# Altium schematic sheet takkkk.SchDoc
size 431 x 279 mm; SheetNumber: 1; SheetTotal: 1; ENG_APP_DATE: --/--/--; DSN_APP_DATE: --/--/--; CHK_APP_DATE: --/--/--
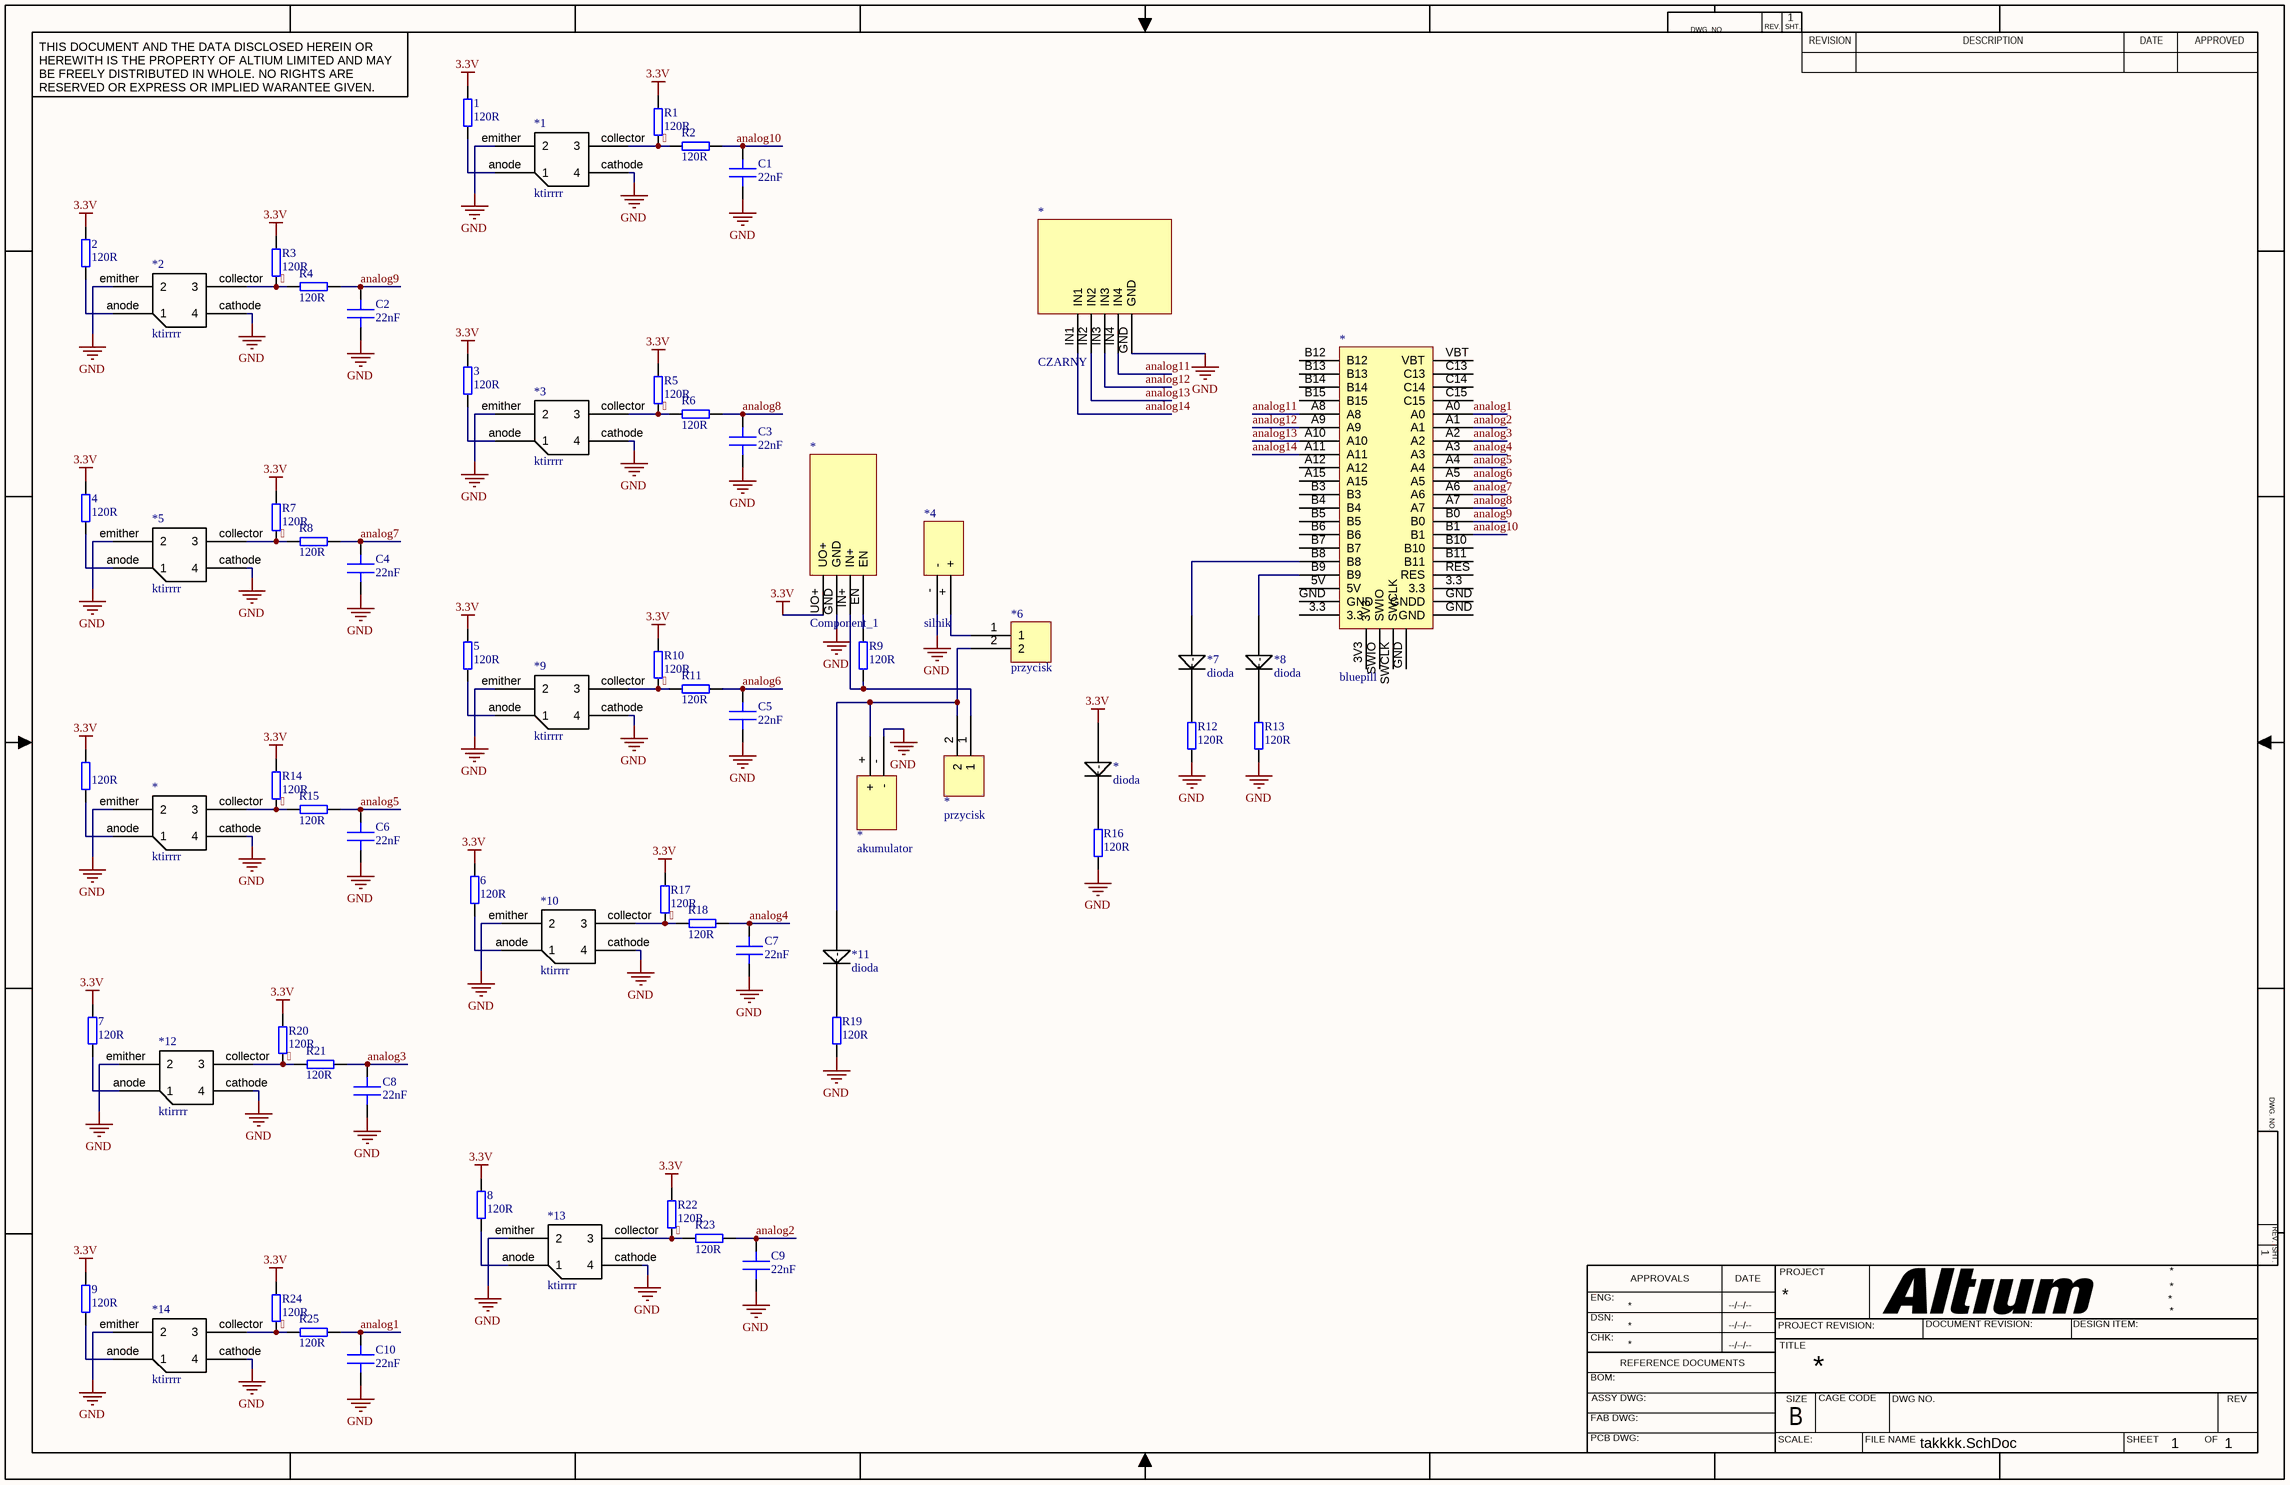
[diagram p0: takkkk.SchDoc]

## Parts
(Parts that share a designator on the sheet are numbered #1, #2 ... from top to bottom, then left to right.)
1  120R  [R 0402]
2  120R  [R 0402]
3  120R  [R 0402]
4  120R  [R 0402]
5  120R  [R 0402]
6  120R  [R 0402]
7  120R  [R 0402]
8  120R  [R 0402]
9  120R  [R 0402]
*1  ktirrrr
*2  ktirrrr
*3  ktirrrr
*4  silnik
*5  ktirrrr
*6  przycisk
*7  dioda
*8  dioda
*9  ktirrrr
*10  ktirrrr
*11  dioda
*12  ktirrrr
*13  ktirrrr
*14  ktirrrr
*#1  CZARNY
*#2  Component_1
*#3  bluepill
*#4  przycisk
*#5  akumulator
*#6  dioda
*#7  ktirrrr
?  120R  [R 0402]
C1  22nF  [C 0402]
C2  22nF  [C 0402]
C3  22nF  [C 0402]
C4  22nF  [C 0402]
C5  22nF  [C 0402]
C6  22nF  [C 0402]
C7  22nF  [C 0402]
C8  22nF  [C 0402]
C9  22nF  [C 0402]
C10  22nF  [C 0402]
R1  120R  [R 0402]
R2  120R  [R 0402]
R3  120R  [R 0402]
R4  120R  [R 0402]
R5  120R  [R 0402]
R6  120R  [R 0402]
R7  120R  [R 0402]
R8  120R  [R 0402]
R9  120R  [R 0402]
R10  120R  [R 0402]
R11  120R  [R 0402]
R12  120R  [R 0402]
R13  120R  [R 0402]
R14  120R  [R 0402]
R15  120R  [R 0402]
R16  120R  [R 0402]
R17  120R  [R 0402]
R18  120R  [R 0402]
R19  120R  [R 0402]
R20  120R  [R 0402]
R21  120R  [R 0402]
R22  120R  [R 0402]
R23  120R  [R 0402]
R24  120R  [R 0402]
R25  120R  [R 0402]

## Nets
3.3V: 1.2 2.2 3.2 4.2 5.2 6.2 7.2 8.2 9.2 *#2.UO+ *#6.1(+) ?.2 R1.1 R3.1 R5.1 R7.1 R10.1 R14.1 R17.1 R20.1 R22.1 R24.1
GND: *1.cathode(4) *1.emither(2) *2.cathode(4) *2.emither(2) *3.cathode(4) *3.emither(2) *4.- *5.cathode(4) *5.emither(2) *9.cathode(4) *9.emither(2) *10.cathode(4) *10.emither(2) *12.cathode(4) *12.emither(2) *13.cathode(4) *13.emither(2) *14.cathode(4) *14.emither(2) *#1.GND *#2.GND *#5.- *#7.cathode(4) *#7.emither(2) C1.2 C2.2 C3.2 C4.2 C5.2 C6.2 C7.2 C8.2 C9.2 C10.2 R12.1 R13.1 R16.1 R19.1
: *1.collector(3) *2.collector(3) *3.collector(3) *5.collector(3) *9.collector(3) *10.collector(3) *12.collector(3) *13.collector(3) *14.collector(3) *#7.collector(3) R1.2 R2.1 R3.2 R4.1 R5.2 R6.1 R7.2 R8.1 R10.2 R11.1 R14.2 R15.1 R17.2 R18.1 R20.2 R21.1 R22.2 R23.1 R24.2 R25.1
analog1: *#3.A0 C10.1 R25.2
analog2: *#3.A1 C9.1 R23.2
analog3: *#3.A2 C8.1 R21.2
analog4: *#3.A3 C7.1 R18.2
analog5: *#3.A4 C6.1 R15.2
analog6: *#3.A5 C5.1 R11.2
analog7: *#3.A6 C4.1 R8.2
analog8: *#3.A7 C3.1 R6.2
analog9: *#3.B0 C2.1 R4.2
analog10: *#3.B1 C1.1 R2.2
analog11: *#1.IN4 *#3.A8
analog12: *#1.IN3 *#3.A9
analog13: *#1.IN2 *#3.A10
analog14: *#1.IN1 *#3.A11
Net1_1: 1.1 *1.anode(1)
Net2_1: 2.1 *2.anode(1)
Net3_1: 3.1 *3.anode(1)
Net4_1: 4.1 *5.anode(1)
Net5_1: 5.1 *9.anode(1)
Net6_1: 6.1 *10.anode(1)
Net7_1: 7.1 *12.anode(1)
Net8_1: 8.1 *13.anode(1)
Net9_1: 9.1 *14.anode(1)
Net*4_+: *4.+ *6.1
Net*6_2: *6.2 *11.1(+) *#4.2 *#5.+
Net*7_1: *7.1(+) *#3.B8
Net*7_2: *7.2(-) R12.2
Net*8_1: *8.1(+) *#3.B9
Net*8_2: *8.2(-) R13.2
Net*11_2: *11.2(-) R19.2
Net*#2_EN: *#2.EN R9.2
Net*#2_IN+: *#2.IN+ *#4.1 R9.1
Net*#6_2: *#6.2(-) R16.2
Net*#7_anode: *#7.anode(1) ?.1

Not connected (* = marked no-connect by the designer): *#3 3.3 3V3 5V A12 A15 B3 B4 B5 B6 B7 B10 B11 B12 B13 B14 B15 C13 C14 C15 GND RES SWCLK SWIO VBT

## Notes on the sheet
- DWG. NO.
- REV.
- SHT.
- THIS DOCUMENT AND THE DATA DISCLOSED HEREIN OR HEREWITH IS THE PROPERTY OF ALTIUM LIMITED AND MAY BE FREELY DISTRIBUTED IN WHOLE. NO RIGHTS ARE RESERVED OR EXPRESS OR IMPLIED WARANTEE GIVEN.
- REVISION
- DESCRIPTION
- DATE
- APPROVED
- ENG:
- APPROVALS
- PROJECT
- DSN:
- CHK:
- REFERENCE DOCUMENTS
- PROJECT REVISION:
- TITLE
- DOCUMENT REVISION:
- DESIGN ITEM:
- BOM:
- FAB DWG:
- PCB DWG:
- ASSY DWG:
- SCALE:
- SIZE
- B
- CAGE CODE
- FILE NAME
- DWG NO.
- SHEET
- OF
- REV

## Library data of the parts
1-9 ? R1-R25 = Resistor: General pourpouse resistor
*4 = akumulator
C1-C10 = Capacitor: MLCC Capacitor